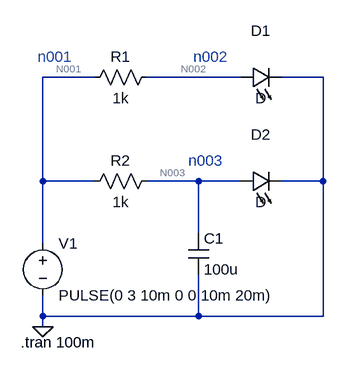
[diagram p0: schematic D-15_v-1-0_e-1_Integral-circuit.asc]
D-15_v-1-0_e-1_Integral-circuit.asc, the LTspice schematic file:
Version 4
SHEET 1 880 680
WIRE 128 -96 48 -96
WIRE 352 -96 208 -96
WIRE 480 -96 416 -96
WIRE 48 64 48 -96
WIRE 128 64 48 64
WIRE 288 64 208 64
WIRE 352 64 288 64
WIRE 480 64 480 -96
WIRE 480 64 416 64
WIRE 288 144 288 64
WIRE 48 160 48 64
WIRE 48 272 48 240
WIRE 288 272 288 208
WIRE 288 272 48 272
WIRE 480 272 480 64
WIRE 480 272 288 272
WIRE 48 288 48 272
FLAG 48 288 0
SYMBOL voltage 48 144 R0
WINDOW 123 0 0 Left 2
WINDOW 39 0 0 Left 2
SYMATTR InstName V1
SYMATTR Value PULSE(0 3 10m 0 0 10m 20m)
SYMBOL res 112 -80 R270
WINDOW 0 32 56 VTop 2
WINDOW 3 0 56 VBottom 2
SYMATTR InstName R1
SYMATTR Value 1k
SYMBOL res 112 80 R270
WINDOW 0 32 56 VTop 2
WINDOW 3 0 56 VBottom 2
SYMATTR InstName R2
SYMATTR Value 1k
SYMBOL LED 352 -80 R270
WINDOW 0 72 32 VTop 2
WINDOW 3 0 32 VBottom 2
SYMATTR InstName D1
SYMBOL LED 352 80 R270
WINDOW 0 72 32 VTop 2
WINDOW 3 0 32 VBottom 2
SYMATTR InstName D2
SYMBOL cap 272 144 R0
SYMATTR InstName C1
SYMATTR Value 100u
TEXT 14 312 Left 2 !.tran 100m
TEXT 272 32 Left 2 ;n003
TEXT 280 -128 Left 2 ;n002
TEXT 40 -128 Left 2 ;n001

The netlist it stands for:
* D-15_v-1-0_e-1_Integral-circuit.asc
V1 N001 0 PULSE(0 3 10m 0 0 10m 20m)
R1 N001 N002 1k
R2 N001 N003 1k
D1 N002 0 D
D2 N003 0 D
C1 N003 0 100u
.model D D
.lib standard.dio
.tran 100m
* n003
* n002
* n001
.backanno
.end

* Results of the author's LTspice run, read from the files saved beside the schematic
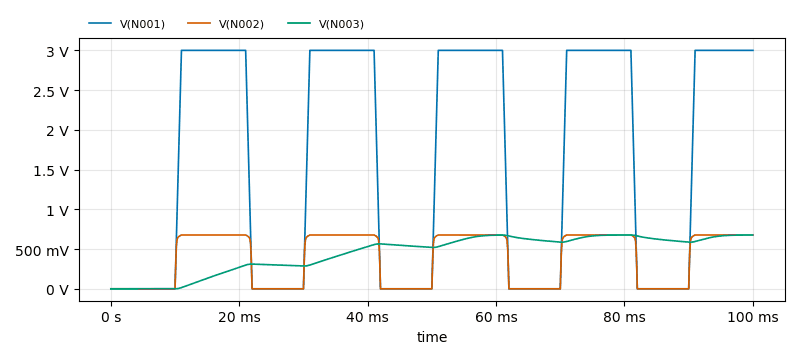
[diagram p1: Transient Analysis of D-15_v-1-0_e-1_Integral-circuit.asc, plotted from the saved traces]
* Transient Analysis, 1 run:
*   V(N001): min 0 V, max 3 V, average 1.605 V, rms 2.164 V, last 3 V
*   V(N002): min 0 V, max 676.9 mV, average 383.2 mV, rms 506.5 mV, last 676.9 mV
*   V(N003): min 0 V, max 676.9 mV, average 455.1 mV, rms 510.2 mV, last 676.8 mV